# EAGLE board XMICRO-VDP V1.1 (EAGLE 6.3)
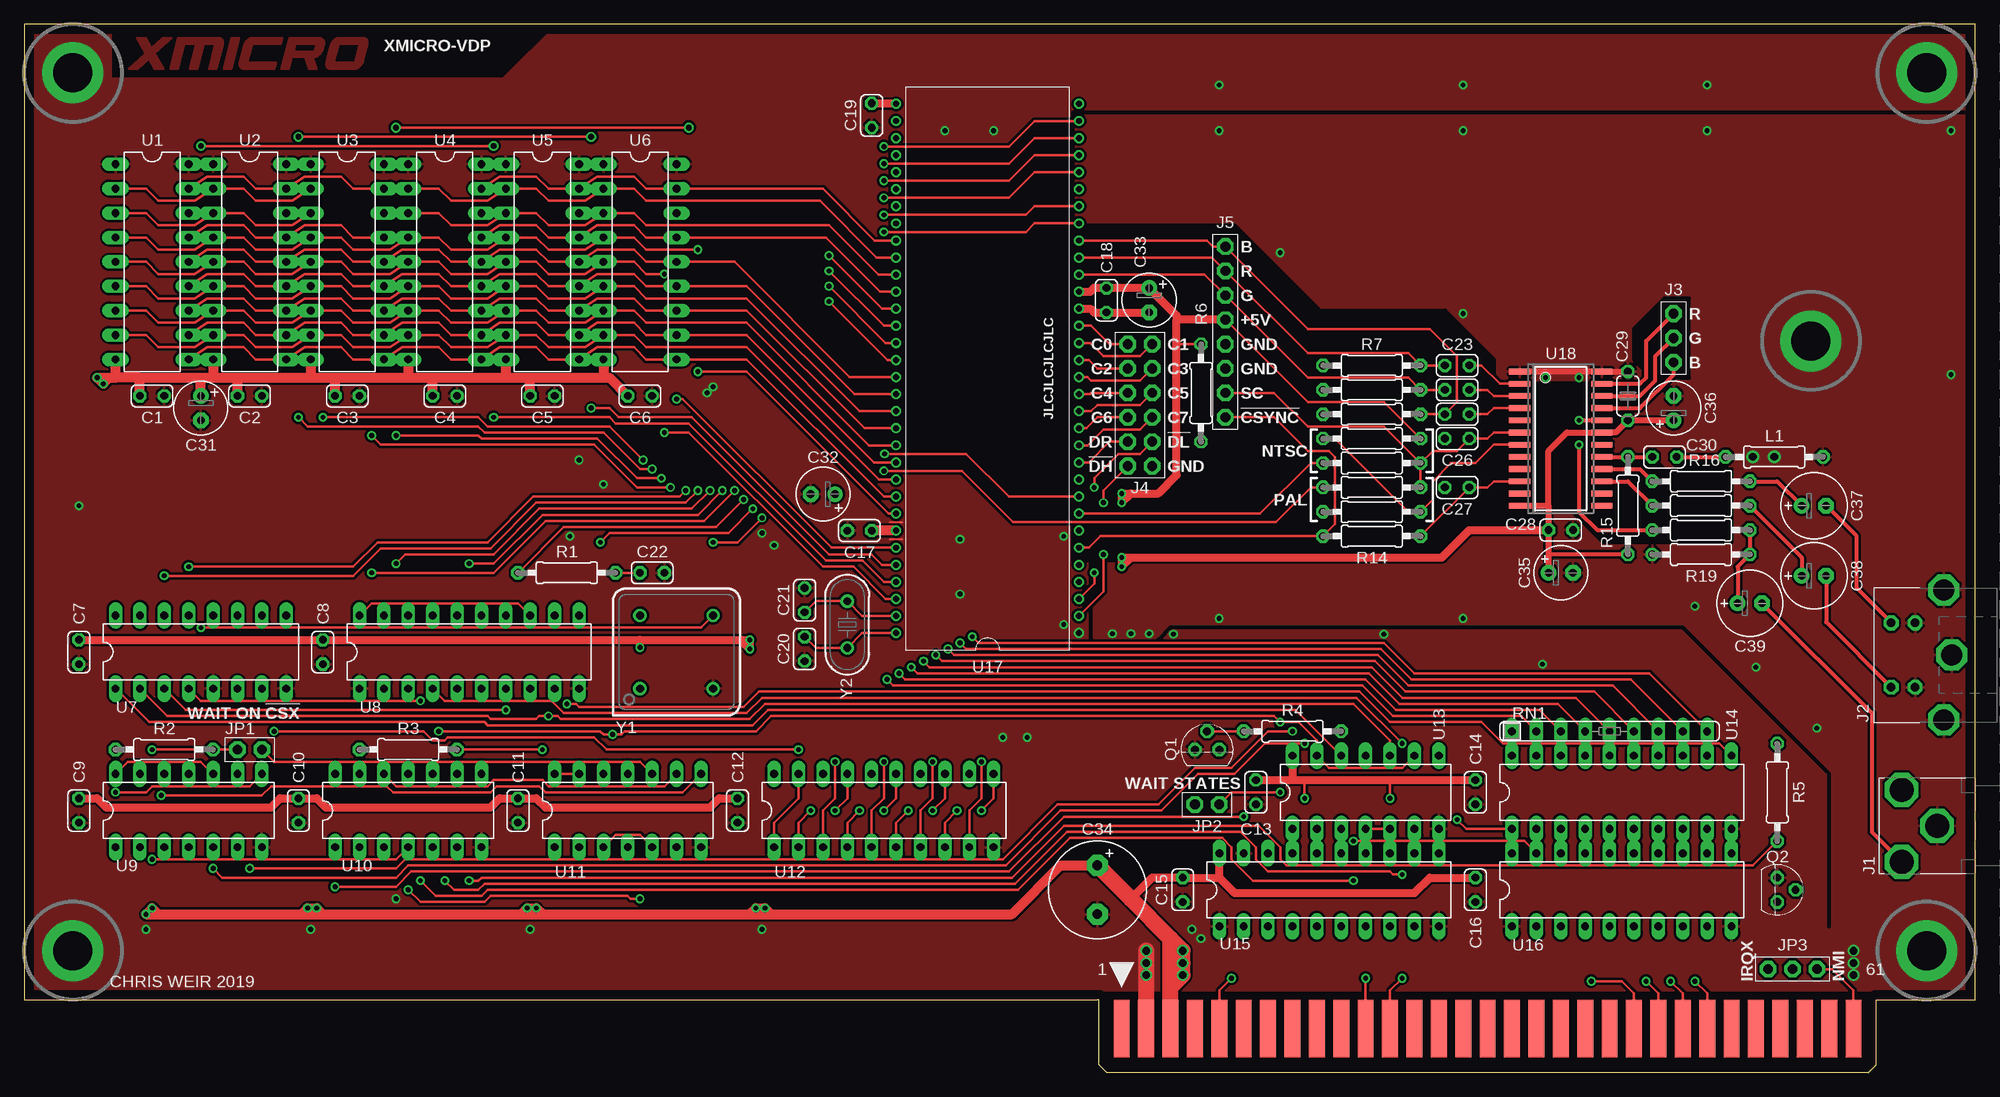
[diagram p5: board, top side]
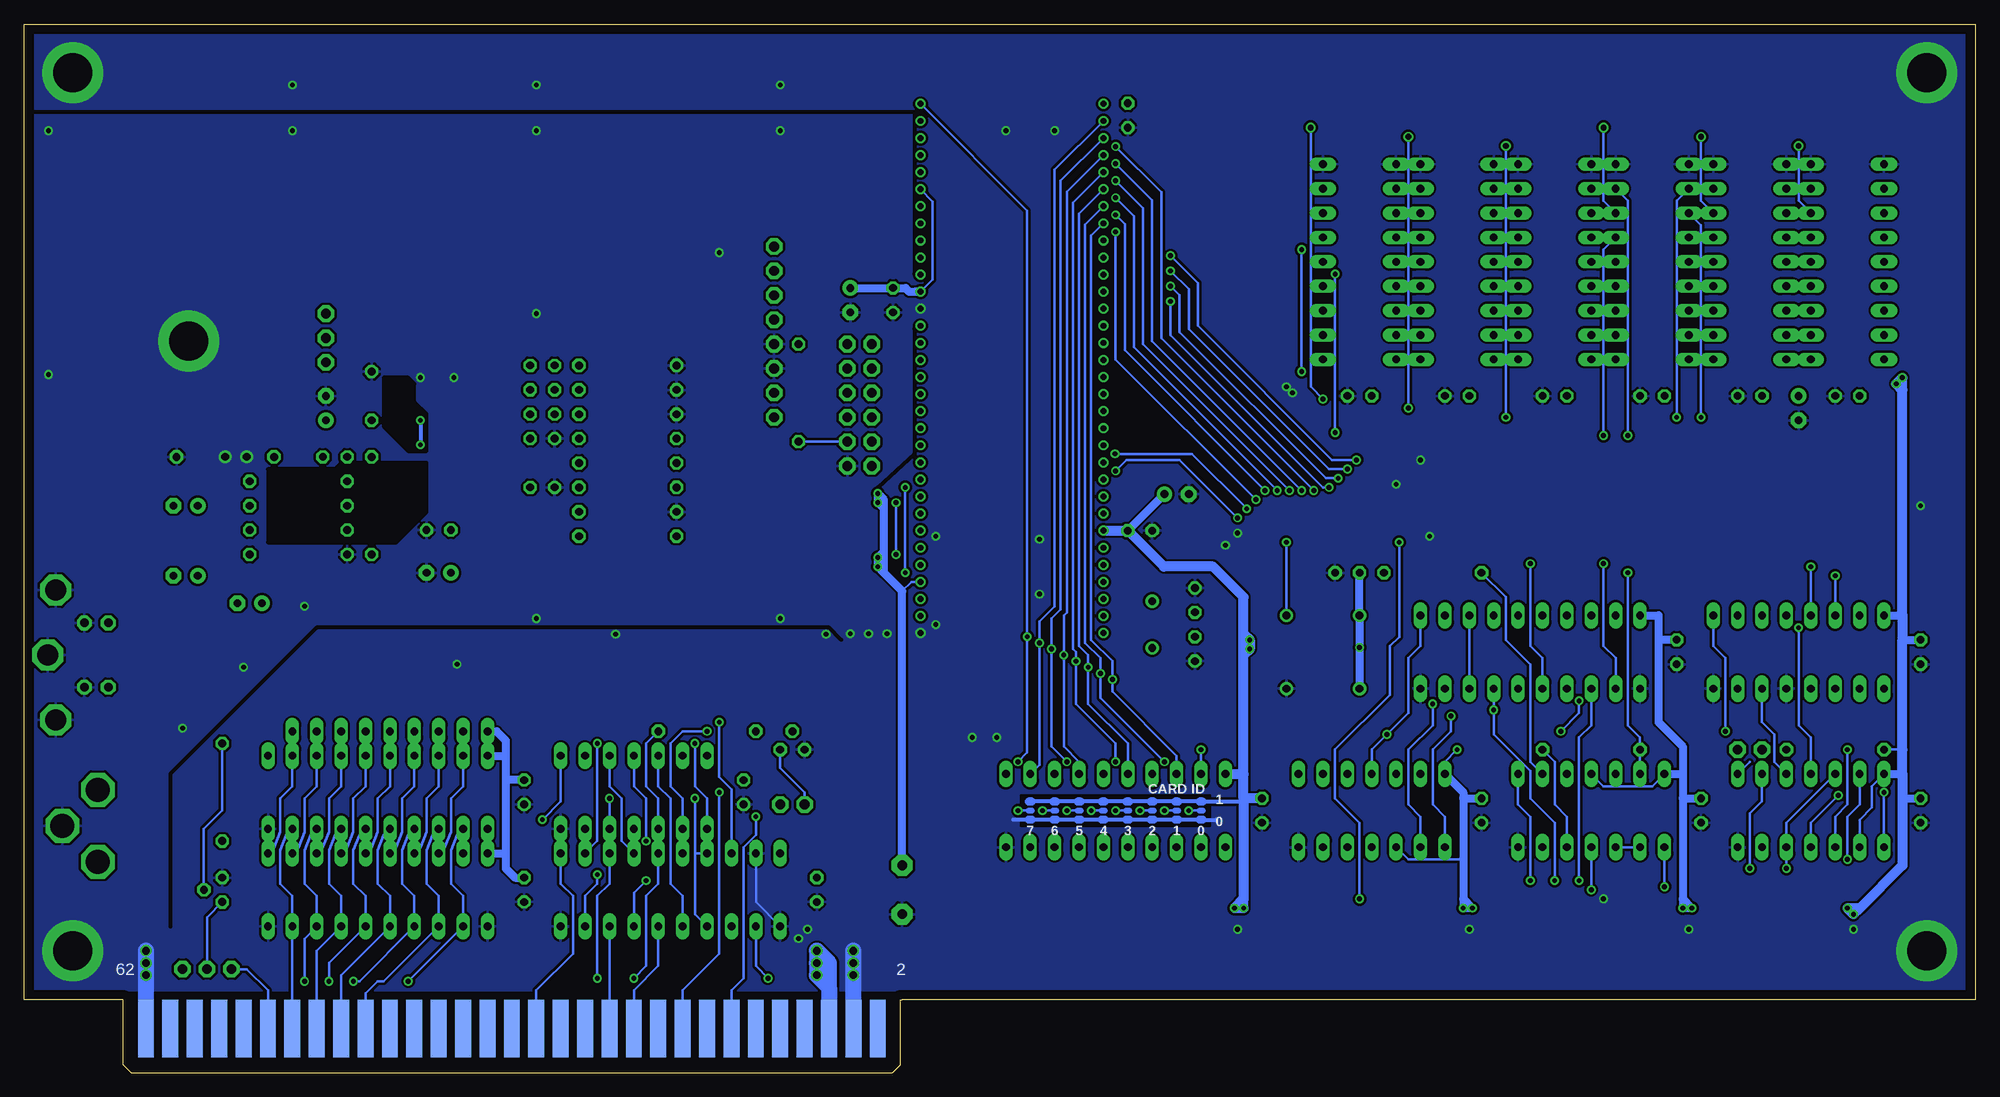
[diagram p6: board, bottom side, seen from below]

Size 203.2 x 109.22 mm. Coordinates in mm from the lower left corner, seen from the top.
Outline: 111.76,7.62 0,7.62 0,109.22 203.2,109.22 203.2,7.62 193.04,7.62
Copper layers (1*16): Top 0.035mm / dielectric 1.5mm / Bottom 0.035mm
Design rules "default *": minimum track width 6mil, minimum drill 0.3mm, track to track 10mil, track to pad 9mil, pad to pad 10mil, via to via 10mil, smd to smd 10mil, copper to edge 40mil, drill to drill 10mil, minimum pad ring 8mil, minimum via ring 8mil, stop-mask expansion 3mil, vias tented up to drill 30mil, thermal gap 10mil
Net classes: 0 default: width 0.254 mm; 1 GND: width 0.254 mm, clearance 0.254 mm to class 0; 2 SUPPLY: width 0.254 mm, clearance 0.254 mm to class 0, clearance 0.381 mm to class 1; 3 LOGO: width 0.152 mm
tRestrict: area 109.2,53.3 to 153,88.3; area 161.3,55.2 to 177.8,63.5; area 167.6,72.4 to 173.4,80.6; 9 lines
bRestrict: area 79.7,25.7 to 99.4,28.9; area 161.3,64.8 to 165.7,72.4; area 161.3,55.2 to 177.8,63.5; 8 lines

## Footprints (pad centres in the part's own frame; a part is rotated, then mirrored left to right if it is on the bottom)
C100 = drill 0.8 octagon: P$1 -1.27,0; P$2 1.27,0
C050-024X044 = drill 0.813 octagon: 1 -2.54,0; 2 2.54,0
E2,5-6 = drill 0.813 pad 1.6: + -1.27,0 | drill 0.813 pad 1.6 octagon: - 1.27,0
C-10-5 = drill 1.016 pad 2.184 octagon: + -2.54,0; - 2.54,0
E2,5-7 = drill 0.813 pad 1.6: + -1.27,0 | drill 0.813 pad 1.6 octagon: - 1.27,0
EDGE62M = smd 1.651 x 5.969: 1 -38.1,-3.01; 3 -35.56,-3.01; 5 -33.02,-3.01; 7 -30.48,-3.01; 9 -27.94,-3.01; 11 -25.4,-3.01; 13 -22.86,-3.01; 15 -20.32,-3.01; 17 -17.78,-3.01; 19 -15.24,-3.01; 21 -12.7,-3.01; 23 -10.16,-3.01; 25 -7.62,-3.01; 27 -5.08,-3.01; 29 -2.54,-3.01; 31 0,-3.01; 33 2.54,-3.01; 35 5.08,-3.01; 37 7.62,-3.01; 39 10.16,-3.01; 41 12.7,-3.01; 43 15.24,-3.01; 45 17.78,-3.01; 47 20.32,-3.01; 49 22.86,-3.01; 51 25.4,-3.01; 53 27.94,-3.01; 55 30.48,-3.01; 57 33.02,-3.01; 59 35.56,-3.01; 61 38.1,-3.01 | smd 1.651 x 5.969 bottom: 2 -38.1,-3.01; 4 -35.56,-3.01; 6 -33.02,-3.01; 8 -30.48,-3.01; 10 -27.94,-3.01; 12 -25.4,-3.01; 14 -22.86,-3.01; 16 -20.32,-3.01; 18 -17.78,-3.01; 20 -15.24,-3.01; 22 -12.7,-3.01; 24 -10.16,-3.01; 26 -7.62,-3.01; 28 -5.08,-3.01; 30 -2.54,-3.01; 32 0,-3.01; 34 2.54,-3.01; 36 5.08,-3.01; 38 7.62,-3.01; 40 10.16,-3.01; 42 12.7,-3.01; 44 15.24,-3.01; 46 17.78,-3.01; 48 20.32,-3.01; 50 22.86,-3.01; 52 25.4,-3.01; 54 27.94,-3.01; 56 30.48,-3.01; 58 33.02,-3.01; 60 35.56,-3.01; 62 38.1,-3.01
PJRAN1 = drill 2.5 octagon: SHUNT 3.75,7.7; SLEEVE 0,4; TIP -3.75,7.7
MINI-DIN4 = drill 0.9 octagon: 1 -3.35,-8.51; 2 3.35,-8.51; 3 -3.35,-11; 4 3.35,-11 | drill 2.2 octagon: G$1 6.76,-5.51; G$2 -6.76,-5.51; G$3 0,-4.7
1X03 = drill 1.016 octagon: 1 -2.54,0; 2 0,0; 3 2.54,0
2X06 = drill 1.016 octagon: 1 -6.35,-1.27; 2 -6.35,1.27; 3 -3.81,-1.27; 4 -3.81,1.27; 5 -1.27,-1.27; 6 -1.27,1.27; 7 1.27,-1.27; 8 1.27,1.27; 9 3.81,-1.27; 10 3.81,1.27; 11 6.35,-1.27; 12 6.35,1.27
1X08 = drill 1.016 octagon: 1 -8.89,0; 2 -6.35,0; 3 -3.81,0; 4 -1.27,0; 5 1.27,0; 6 3.81,0; 7 6.35,0; 8 8.89,0
1X02 = drill 1.016 octagon: 1 -1.27,0; 2 1.27,0
0207/10 = drill 0.813 octagon: 1 -5.08,0; 2 5.08,0
TO92 = drill 0.813 octagon: 1 -1.27,0; 2 0,1.905; 3 1.27,0
SIL9 = drill 0.813 long: 1 -10.16,0; 2 -7.62,0; 3 -5.08,0; 4 -2.54,0; 5 0,0; 6 2.54,0; 7 5.08,0; 8 7.62,0; 9 10.16,0
DIL18 = drill 0.813 long: 1 -10.16,-3.81; 2 -7.62,-3.81; 3 -5.08,-3.81; 4 -2.54,-3.81; 5 0,-3.81; 6 2.54,-3.81; 7 5.08,-3.81; 8 7.62,-3.81; 9 10.16,-3.81; 10 10.16,3.81; 11 7.62,3.81; 12 5.08,3.81; 13 2.54,3.81; 14 0,3.81; 15 -2.54,3.81; 16 -5.08,3.81; 17 -7.62,3.81; 18 -10.16,3.81
DIL16 = drill 0.813 long: 1 -8.89,-3.81; 2 -6.35,-3.81; 3 -3.81,-3.81; 4 -1.27,-3.81; 5 1.27,-3.81; 6 3.81,-3.81; 7 6.35,-3.81; 8 8.89,-3.81; 9 8.89,3.81; 10 6.35,3.81; 11 3.81,3.81; 12 1.27,3.81; 13 -1.27,3.81; 14 -3.81,3.81; 15 -6.35,3.81; 16 -8.89,3.81
DIL20 = drill 0.813 long: 1 -11.43,-3.81; 2 -8.89,-3.81; 3 -6.35,-3.81; 4 -3.81,-3.81; 5 -1.27,-3.81; 6 1.27,-3.81; 7 3.81,-3.81; 8 6.35,-3.81; 9 8.89,-3.81; 10 11.43,-3.81; 11 11.43,3.81; 12 8.89,3.81; 13 6.35,3.81; 14 3.81,3.81; 15 1.27,3.81; 16 -1.27,3.81; 17 -3.81,3.81; 18 -6.35,3.81; 19 -8.89,3.81; 20 -11.43,3.81
DIL14 = drill 0.813 long: 1 -7.62,-3.81; 2 -5.08,-3.81; 3 -2.54,-3.81; 4 0,-3.81; 5 2.54,-3.81; 6 5.08,-3.81; 7 7.62,-3.81; 8 7.62,3.81; 9 5.08,3.81; 10 2.54,3.81; 11 0,3.81; 12 -2.54,3.81; 13 -5.08,3.81; 14 -7.62,3.81
SDIP64 = drill 0.61 pad 1.016: 1 -27.559,-9.525; 2 -25.781,-9.525; 3 -24.003,-9.525; 4 -22.225,-9.525; 5 -20.447,-9.525; 6 -18.669,-9.525; 7 -16.891,-9.525; 8 -15.113,-9.525; 9 -13.335,-9.525; 10 -11.557,-9.525; 11 -9.779,-9.525; 12 -8.001,-9.525; 13 -6.223,-9.525; 14 -4.445,-9.525; 15 -2.667,-9.525; 16 -0.889,-9.525; 17 0.889,-9.525; 18 2.667,-9.525; 19 4.445,-9.525; 20 6.223,-9.525; 21 8.001,-9.525; 22 9.779,-9.525; 23 11.557,-9.525; 24 13.335,-9.525; 25 15.113,-9.525; 26 16.891,-9.525; 27 18.669,-9.525; 28 20.447,-9.525; 29 22.225,-9.525; 30 24.003,-9.525; 31 25.781,-9.525; 32 27.559,-9.525; 33 27.559,9.525; 34 25.781,9.525; 35 24.003,9.525; 36 22.225,9.525; 37 20.447,9.525; 38 18.669,9.525; 39 16.891,9.525; 40 15.113,9.525; 41 13.335,9.525; 42 11.557,9.525; 43 9.779,9.525; 44 8.001,9.525; 45 6.223,9.525; 46 4.445,9.525; 47 2.667,9.525; 48 0.889,9.525; 49 -0.889,9.525; 50 -2.667,9.525; 51 -4.445,9.525; 52 -6.223,9.525; 53 -8.001,9.525; 54 -9.779,9.525; 55 -11.557,9.525; 56 -13.335,9.525; 57 -15.113,9.525; 58 -16.891,9.525; 59 -18.669,9.525; 60 -20.447,9.525; 61 -22.225,9.525; 62 -24.003,9.525; 63 -25.781,9.525; 64 -27.559,9.525
SOP-24 = smd 0.6 x 2.2: 1 -6.985,-4.282; 2 -5.715,-4.282; 3 -4.445,-4.282; 4 -3.175,-4.282; 5 -1.905,-4.282; 6 -0.635,-4.282; 7 0.635,-4.282; 8 1.905,-4.282; 9 3.175,-4.282; 10 4.445,-4.282; 11 5.715,-4.282; 12 6.985,-4.282; 13 6.985,4.282; 14 5.715,4.282; 15 4.445,4.282; 16 3.175,4.282; 17 1.905,4.282; 18 0.635,4.282; 19 -0.635,4.282; 20 -1.905,4.282; 21 -3.175,4.282; 22 -4.445,4.282; 23 -5.715,4.282; 24 -6.985,4.282
DIL08S = drill 0.813: 1 -3.81,-3.81; 4 3.81,-3.81; 5 3.81,3.81; 8 -3.81,3.81
HC-49US = drill 0.813: 1 -2.44,0; 2 2.44,0

## Placement (x,y rotation side)
C1  0.1uF  [C100]  13.34,70.48 0 top
C2  0.1uF  [C100]  23.5,70.48 0 top
C3  0.1uF  [C100]  33.66,70.48 0 top
C4  0.1uF  [C100]  43.81,70.48 0 top
C5  0.1uF  [C100]  53.98,70.48 0 top
C6  0.1uF  [C100]  64.14,70.48 0 top
C7  0.1uF  [C100]  5.71,43.81 270 top
C8  0.1uF  [C100]  31.11,43.81 270 top
C9  0.1uF  [C100]  5.71,27.3 270 top
C10  0.1uF  [C100]  28.57,27.3 270 top
C11  0.1uF  [C100]  51.44,27.3 270 top
C12  0.1uF  [C100]  74.3,27.3 270 top
C13  0.1uF  [C100]  128.27,29.21 270 top
C14  0.1uF  [C100]  151.13,29.21 270 top
C15  0.1uF  [C100]  120.65,19.05 270 top
C16  0.1uF  [C100]  151.13,19.05 270 top
C17  0.1uF  [C100]  87,56.45 180 top
C18  0.1uF  [C100]  112.71,80.45 270 top
C19  0.1uF  [C100]  88.27,99.7 270 top
C20  22pF  [C100]  81.28,44.13 270 top
C21  22pF  [C100]  81.28,49.21 90 top
C22  0.1uF  [C100]  65.41,52.07 0 top
C23  0.1uF  [C100]  149.22,73.66 0 top
C24  0.1uF  [C100]  149.22,71.12 0 top
C25  0.1uF  [C100]  149.22,68.58 0 top
C26  5pF  [C100]  149.22,66.04 180 top
C27  47pF  [C100]  149.22,60.96 180 top
C28  10nF  [C100]  160.02,56.52 0 top
C29  10nF  [C050-024X044]  167,70.48 90 top
C30  28pF  [C100]  170.81,64.14 0 top
C31  47uF  [E2,5-6]  18.41,69.22 270 top
C32  47uF  [E2,5-6]  83.19,60.26 180 top
C33  47uF  [E2,5-6]  117.16,80.45 270 top
C34  470uF  [C-10-5]  111.76,19.05 270 top
C35  47uF  [E2,5-6]  160.02,52.07 0 top
C36  47uF  [E2,5-6]  171.77,69.22 90 top
C37  220uF  [E2,5-7]  186.37,59.05 0 top
C38  220uF  [E2,5-7]  186.37,51.75 0 top
C39  220uF  [E2,5-7]  179.71,48.89 0 top
CE1  XMICRO-BUS-EDGE62M  [EDGE62M]  152.4,7.62 0 top
J1  PJRAN1XU04AUX  [PJRAN1]  203.2,25.72 90 top
J2  MINI-DIN4  [MINI-DIN4]  205.42,43.5 270 top
J3  PINHD1X3  [1X03]  171.77,76.52 270 top
J4  PINHD-2X6  [2X06]  116.2,69.53 270 top
J5  PINHD-1X8  [1X08]  125.09,77.15 270 top
JP1  PINHD-1X2THRU  [1X02]  23.5,33.66 180 top
JP2  PINHD-1X2THRU  [1X02]  123.19,27.94 0 top
JP3  PINHD1X3THRU  [1X03]  184.15,10.79 0 top
L1  68uH  [0207/10]  182.25,64.14 0 top
Q1  VN2106  [TO92]  123.19,33.66 0 top
Q2  VN2106  [TO92]  182.56,19.05 270 top
R1  3.3k  [0207/10]  56.52,52.07 0 top
R2  10k  [0207/10]  14.61,33.66 180 top
R3  3.3k  [0207/10]  40.01,33.66 0 top
R4  0  [0207/10]  132.08,35.56 180 top
R5  0  [0207/10]  182.56,29.21 90 top
R6  3.3k  [0207/10]  122.56,70.8 90 top
R7  470  [0207/10]  140.34,73.66 0 top
R8  470  [0207/10]  140.34,71.12 0 top
R9  470  [0207/10]  140.34,68.58 0 top
R10  0  [0207/10]  140.34,66.04 0 top
R11  2.2k  [0207/10]  140.34,63.5 0 top
R12  2.2k  [0207/10]  140.34,60.96 0 top
R13  0  [0207/10]  140.34,58.42 180 top
R14  2.2k  [0207/10]  140.34,55.88 0 top
R15  3.32k/1%  [0207/10]  167,59.05 90 top
R16  75  [0207/10]  174.62,61.59 0 top
R17  75  [0207/10]  174.62,59.05 0 top
R18  43  [0207/10]  174.62,56.52 0 top
R19  240  [0207/10]  174.62,53.97 0 top
RN1  3.3k  [SIL9]  165.1,35.56 0 top
U1  41464  [DIL18]  13.34,84.45 270 top
U2  41464  [DIL18]  23.5,84.45 270 top
U3  41464  [DIL18]  33.66,84.45 270 top
U4  41464  [DIL18]  43.81,84.45 270 top
U5  41464  [DIL18]  53.98,84.45 270 top
U6  41464  [DIL18]  64.14,84.45 270 top
U7  74138  [DIL16]  18.41,43.81 0 top
U8  74373  [DIL20]  46.35,43.81 0 top
U9  7474  [DIL14]  17.14,27.3 0 top
U10  7414  [DIL14]  40.01,27.3 0 top
U11  7404  [DIL14]  62.87,27.3 0 top
U12  74244  [DIL20]  89.53,27.3 0 top
U13  7432  [DIL14]  139.7,29.21 0 top
U14  74574  [DIL20]  166.37,29.21 0 top
U15  74244  [DIL20]  135.89,19.05 0 top
U16  74245  [DIL20]  166.37,19.05 0 top
U17  V9958  [SDIP64]  100.33,73.34 90 top
U18  CXA2075  [SOP-24]  160.02,66.04 270 top
Y1  5MHz  [DIL08S]  67.94,43.81 0 top
Y2  21.47727MHz  [HC-49US]  85.72,46.67 90 top

## Tracks (layer width: path | path; a pad name or v marks a point on that pad's centre or on a via)
!BCSX  (via drill 0.5)
  Top 0.254: CE1.9 124.46,8.57 v125.73,9.84
  Bottom 0.254: v125.73,9.84 127,11.11 U15.2
!BRD  (via drill 0.5)
  Top 0.254: CE1.21 v139.7,9.84
  Bottom 0.254: v139.7,9.84 138.43,11.11 138.43,18.41 137.16,19.68 U15.15
!BRST  (via drill 0.5)
  Top 0.254: v127,26.67 108.27,26.67 102.55,20.96 40.32,20.96 38.73,19.37 v32.38,19.37
  Bottom 0.254: CE1.14 129.54,8.57 128.27,9.84 128.27,23.5 127,24.77 v127,26.67 | v32.38,19.37 U10.1
!BWAIT  (via drill 0.5)
  Top 0.254: v130.81,29.21 125.73,29.21 JP2.2
  Bottom 0.254: CE1.18 134.62,8.57 130.81,12.38 v130.81,29.21
!BWR
  Bottom 0.254: CE1.22 139.7,8.57 137.16,11.11 U15.6
!CSIDR  (via drill 0.5)
  Top 0.254: U12.1 78.11,26.04 80.64,28.57 U12.19 | v26.04,35.56 41.59,35.56 42.55,34.61 43.81,34.61 44.13,34.92 59.37,34.92 60.64,33.66 v80.64,33.66
  Bottom 0.254: U7.9 27.3,44.45 26.04,43.18 v26.04,35.56 | v80.64,33.66 U12.19
!CSVR  (via drill 0.5)
  Top 0.254: v17.14,52.7 34.29,52.7 36.83,55.24 48.26,55.24 53.02,60.01 68.26,60.01 v68.9,60.64 | v89.53,96.46 102.55,96.46 105.22,99.12 U17.31
  Bottom 0.254: v17.14,52.7 U7.13 | v89.53,96.46 84.77,91.69 84.77,76.52 v68.9,60.64
!CSVW  (via drill 0.5)
  Top 0.254: v70.17,60.64 68.9,59.37 53.34,59.37 48.58,54.61 37.15,54.61 34.29,51.75 v14.61,51.75 | v89.53,94.68 102.55,94.68 105.22,97.34 U17.30
  Bottom 0.254: v14.61,51.75 U7.14 | v89.53,94.68 85.72,90.87 85.72,76.2 v70.17,60.64
!CSX  (via drill 0.5)
  Top 0.254: U13.9 143.51,31.75 135.89,31.75 U13.13 134.62,34.61 132.72,36.51 v130.81,36.51 130.18,37.15 77.79,37.15 76.2,35.56 62.55,35.56 62.23,35.24 v61.28,35.24 60.33,35.24 60.01,35.56 v43.18,35.56 | U7.4 18.41,38.73 v41.27,38.73
  Bottom 0.254: U15.18 129.54,29.53 130.81,30.8 v130.81,36.51 | U11.11 62.87,33.66 v61.28,35.24 59.05,37.46 59.05,43.18 57.78,44.45 U8.11 | v41.27,38.73 41.27,37.46 v43.18,35.56
!CSYNC
  Top 0.254: U17.6 110.87,54.67 112.08,55.88 R14.1 136.53,57.15 136.53,64.14 135.89,64.77 133.67,64.77 130.18,68.26 J5.8
!DHCLK  (via drill 0.5)
  Top 0.254: U17.2 112.39,50.1 v112.39,53.97 | v112.39,59.37 112.39,60.64 J4.11
  Bottom 0.254: v112.39,53.97 v112.39,59.37
!DLCLK  (via drill 0.5)
  Top 0.254: U17.3 111.44,50.93 v111.44,52.07 | v111.44,60.96 111.44,61.91 113.98,64.45 116.2,64.45 J4.10
  Bottom 0.254: v111.44,52.07 v111.44,60.96 | J4.10 R6.1
!RD
  Top 0.254: U13.12 132.4,37.78 77.47,37.78 75.88,36.2 48.26,36.2 47.94,36.51 13.02,36.51 U7.1
  Bottom 0.254: U15.5 134.62,18.41 135.89,19.68 135.89,28.57 137.16,29.85 U13.12
!RST  (via drill 0.5)
  Top 0.254: U17.9 102.55,60.01 98.11,64.45 v89.6,64.45 | v75.88,58.74 73.34,56.2 60.96,56.2 v60.01,55.24 | v13.34,22.23 38.73,22.23 U10.4 | v64.14,18.1 63.18,18.1 62.87,18.41 48.58,18.41 47.94,17.78 41.27,17.78 v40.01,19.05
  Bottom 0.254: v89.6,64.45 81.6,64.45 v75.88,58.74 | U9.13 12.06,27.94 13.34,26.67 v13.34,22.23 | v60.01,55.24 60.01,45.4 60.96,44.45 60.96,39.37 66.67,33.66 66.67,28.57 64.14,26.04 v64.14,18.1 | v40.01,19.05 U10.4
!VCAS0  (via drill 0.5, 0.6)
  Top 0.254: v48.9,96.52 v18.41,96.52 | v48.9,68.26 60.96,68.26 61.59,67.63 69.22,67.63 83.5,53.34 87.31,53.34 89.53,51.12 U17.61
  Bottom 0.254: 48.9,89.54 v48.9,96.52 | v18.41,96.52 18.41,90.81 U1.16 | U4.16 48.9,89.54 | 48.9,89.54 v48.9,68.26
!VCAS1  (via drill 0.5, 0.6)
  Top 0.254: U17.60 89.34,52.9 88.27,53.97 83.82,53.97 69.53,68.26 61.91,68.26 60.96,69.22 v59.05,69.22 | v59.05,97.47 v28.57,97.47
  Bottom 0.254: 59.05,89.54 v59.05,97.47 | v28.57,97.47 28.57,90.81 U2.16 | U5.16 59.05,89.54 | 59.05,89.54 v59.05,69.22
!VCAS2  (via drill 0.5, 0.6)
  Top 0.254: v38.73,98.43 v69.22,98.43 | v67.94,70.17 68.58,70.17 84.07,54.67 U17.59
  Bottom 0.254: U3.16 38.73,90.81 v38.73,98.43 | v69.22,98.43 69.22,89.54 | U6.16 69.22,89.54 | 69.22,89.54 69.22,71.44 v67.94,70.17
!VINT  (via drill 0.5)
  Top 0.254: U17.25 105.22,88.45 104.33,87.57 v89.53,87.57 | v74.93,59.69 72.07,56.83 56.2,56.83 R1.1
  Bottom 0.254: U10.9 46.35,32.38 46.35,42.54 48.9,45.09 48.9,49.53 R1.1 | v89.53,87.57 89.53,74.3 v74.93,59.69
!VRAS  (via drill 0.5)
  Top 0.254: v66.67,66.67 69.22,66.67 83.19,52.7 86.36,52.7 89.72,49.34 U17.62 | U1.5 12.7,84.45 13.97,83.19 17.78,83.19 U2.5 22.86,84.45 24.13,83.19 27.94,83.19 U3.5 33.02,84.45 34.29,83.19 38.1,83.19 U4.5 43.18,84.45 44.45,83.19 48.26,83.19 U5.5 53.34,84.45 54.61,83.19 58.42,83.19 U6.5 63.5,84.45 64.77,83.19 v66.67,83.19
  Bottom 0.254: v66.67,83.19 v66.67,66.67
!VWAIT  (via drill 0.5)
  Top 0.254: U17.26 105.22,90.23 104.33,89.34 v89.53,89.34 | v73.98,60.64 70.8,57.47 54.29,57.47 48.9,52.07 v36.2,52.07
  Bottom 0.254: U10.13 R3.1 34.92,34.92 36.2,36.2 v36.2,52.07 | v89.53,89.34 88.58,88.39 88.58,75.25 v73.98,60.64
!WR  (via drill 0.5)
  Top 0.254: U13.10 142.24,34.61 138.43,38.42 77.15,38.42 75.56,36.83 55.88,36.83 55.56,37.15 v54.61,37.15 53.66,37.15 53.34,36.83 48.58,36.83 48.26,37.15 14.92,37.15 U7.2
  Bottom 0.254: U15.14 140.97,24.13 140.97,28.57 142.24,29.85 U13.10 | U11.1 55.24,26.67 56.52,27.94 56.52,33.66 54.61,35.56 v54.61,37.15
A0  (via drill 0.5)
  Top 0.254: v138.43,20 127.95,20 125.73,22.23 125.73,23.5 124.78,24.45 108.9,24.45 103.5,19.05 48.26,19.05 47.62,18.41 42.86,18.41 v41.27,20
  Bottom 0.254: U15.7 139.7,18.73 v138.43,20 | v41.27,20 41.27,34.92 40.01,36.2 U8.3
A1  (via drill 0.5)
  Top 0.254: v143.51,34.29 138.75,39.05 76.83,39.05 75.25,37.46 56.2,37.46 54.93,38.73 43.81,38.73 U8.4
  Bottom 0.254: U15.12 143.51,24.13 v143.51,34.29
A7  (via drill 0.5)
  Top 0.254: v143.51,20.64 142.56,20.64 142.24,20.96 129.54,20.96 128.27,22.23 128.27,23.5 126.68,25.08 108.58,25.08 103.19,19.68 47.94,19.68 47.31,19.05 44.77,19.05 v43.81,20 | U7.3 16.83,37.78 v50.16,37.78
  Bottom 0.254: U15.9 144.78,18.41 143.51,19.68 v143.51,20.64 | v43.81,20 43.81,26.04 46.35,28.57 46.35,31.43 50.16,35.24 v50.16,37.78 U8.7
B
  Top 0.254: R9.2 C25.P$1 149.22,69.85 149.22,74.61 146.37,77.47 133.67,77.47 J5.1 123.83,86.04 123.19,86.68 U17.24
BA0  (via drill 0.5)
  Top 0.254: CE1.23 142.24,8.57 v143.51,9.84
  Bottom 0.254: v143.51,9.84 143.51,18.41 142.24,19.68 U15.13
BA1
  Bottom 0.254: CE1.24 U15.8
BA7
  Bottom 0.254: CE1.30 149.86,8.57 146.05,12.38 146.05,18.41 147.32,19.68 U15.11
C0
  Top 0.254: U17.19 111.12,77.79 113.03,75.88 J4.1
C1
  Top 0.254: U17.18 111,76.01 112.39,74.61 116.2,74.61 J4.2
C2
  Top 0.254: U17.17 110.87,74.23 111.76,73.34 J4.3
C3
  Top 0.254: U17.16 110.74,72.45 111.12,72.07 116.2,72.07 J4.4
C4
  Top 0.254: U17.15 111,70.68 111.12,70.8 J4.5
C5
  Top 0.254: U17.14 111.12,68.9 111.76,69.53 116.2,69.53 J4.6
C6
  Top 0.254: U17.13 110.62,67.12 111.76,68.26 J4.7
C7
  Top 0.254: U17.12 110.74,65.34 112.39,66.99 116.2,66.99 J4.8
CBDR
  Top 0.254: U17.11 110.87,63.56 113.03,65.72 J4.9
D0  (via drill 0.5)
  Top 0.254: RN1.2 155.89,37.15 142.56,37.15 139.38,40.32 90.49,40.32 v89.85,40.96
  Bottom 0.254: U16.18 159.38,23.5 158.75,25.08 158.75,28.57 157.48,29.85 U14.19 RN1.2 | U17.40 92.08,87.19 92.08,45.09 89.85,42.86 v89.85,40.96 89.85,39.69 83.19,33.02 U12.18
D1  (via drill 0.5)
  Top 0.254: RN1.3 157.8,37.78 142.88,37.78 139.7,40.96 91.76,40.96 v91.12,41.59 | U12.3 83.19,27.3 84.45,28.57 v84.45,32.38
  Bottom 0.254: U16.17 161.93,23.5 161.29,25.08 161.29,28.57 160.02,29.85 U14.18 RN1.3 | U17.39 92.71,88.33 92.71,44.77 91.12,43.18 v91.12,41.59 91.12,39.05 v84.45,32.38
D2  (via drill 0.5)
  Top 0.254: RN1.4 159.7,38.42 143.19,38.42 140.02,41.59 93.03,41.59 v92.39,42.23
  Bottom 0.254: U16.16 164.47,23.5 163.83,25.08 163.83,28.57 162.56,29.85 U14.17 RN1.4 | U17.38 93.34,89.47 93.34,44.45 92.39,43.5 v92.39,42.23 92.39,38.42 88.27,34.29 U12.16
D3  (via drill 0.5)
  Top 0.254: RN1.5 161.61,39.05 143.51,39.05 140.34,42.23 94.3,42.23 v93.66,42.86 | U12.5 88.27,27.3 89.53,28.57 v89.53,32.38
  Bottom 0.254: U16.15 167,23.5 166.37,25.08 166.37,28.57 165.1,29.85 U14.16 RN1.5 | U17.37 93.98,90.62 93.98,44.13 93.66,43.81 v93.66,42.86 93.66,38.42 89.53,34.29 v89.53,32.38
D4  (via drill 0.5)
  Top 0.254: RN1.6 163.51,39.69 143.83,39.69 140.65,42.86 95.57,42.86 v94.93,43.5
  Bottom 0.254: U16.14 169.54,23.5 168.91,25.08 168.91,28.57 167.64,29.85 U14.15 RN1.6 | U17.36 94.61,91.76 94.61,47.94 94.93,47.62 v94.93,43.5 94.93,33.97 93.34,32.38 U12.14
D5  (via drill 0.5)
  Top 0.254: RN1.7 165.42,40.32 144.15,40.32 140.97,43.5 96.84,43.5 v96.2,44.13 | U12.7 93.34,27.3 94.61,28.57 v94.61,32.38
  Bottom 0.254: U16.13 172.09,23.5 171.45,25.08 171.45,28.57 170.18,29.85 U14.14 RN1.7 | U17.35 95.25,92.9 95.25,48.26 96.2,47.31 v96.2,44.13 96.2,33.97 v94.61,32.38
D6  (via drill 0.5)
  Top 0.254: RN1.8 167.32,40.96 144.46,40.96 141.29,44.13 98.11,44.13 v97.47,44.77
  Bottom 0.254: U16.12 174.62,23.5 173.99,25.08 173.99,28.57 172.72,29.85 U14.13 RN1.8 | U17.34 95.89,94.04 95.89,48.58 97.47,46.99 v97.47,44.77 97.47,32.07 U12.12
D7  (via drill 0.5)
  Top 0.254: RN1.9 169.23,41.59 144.78,41.59 141.6,44.77 99.38,44.77 v98.74,45.4 | U12.9 98.42,27.3 99.69,28.57 v99.69,32.38
  Bottom 0.254: U16.11 177.16,23.5 176.53,25.08 176.53,28.57 175.26,29.85 U14.12 RN1.9 | U17.32 98.74,89.79 v98.74,45.4 98.74,33.34 v99.69,32.38
G
  Top 0.254: C24.P$1 R8.2 144.15,72.39 133.67,72.39 J5.3 122.94,83.12 U17.22
GND  (via drill 0.5, 0.8, 0.8 pad 1.32, 4.06 pad 6.35)
  Top 0.229: 90.17,55.56 91.44,55.56 | 90.17,57.34 91.44,57.34
  Top 0.61: U18.1 U18.24 C29.2
  Top 0.813: U17.20 111.03,79.56 111.41,79.18 C33.-
  Top 1.651: v116.84,12.7 v116.84,11.43 v116.84,10.16 CE1.4
  Bottom 0.254: U15.19 127,17.78 U15.1
  Bottom 0.406: 98.58,26.35 100.17,26.35 | 96.04,26.35 98.27,26.35 | 93.5,26.35 95.73,26.35 | 90.96,26.35 93.19,26.35 | 88.42,26.35 90.65,26.35 | 85.88,26.35 88.11,26.35 | 83.34,26.35 85.57,26.35 | 80.8,26.35 83.03,26.35 | 80.49,26.35 79.06,26.35
  Bottom 0.813: 98.27,26.35 98.58,26.35 | 95.73,26.35 96.04,26.35 | 93.19,26.35 93.5,26.35 | 90.65,26.35 90.96,26.35 | 88.11,26.35 88.42,26.35 | 85.57,26.35 85.88,26.35 | 83.03,26.35 83.34,26.35 | 80.49,26.35 80.8,26.35
  Bottom 1.651: CE1.4 v116.84,10.16 v116.84,11.43 v116.84,12.7 | CE1.62 v190.5,10.16 v190.5,11.43 v190.5,12.7
  other vias: 5.08,12.7 5.08,104.14 158.43,72.39 161.93,72.39 198.12,12.7 198.12,104.14 57.78,63.82 182.25,64.14 180.02,64.14 121.6,14.92 122.56,13.97 56.83,55.88 78.11,54.93 76.83,56.2 119.7,45.67 141.6,45.67 158.12,42.54 108.27,46.67 104.46,34.92 101.92,34.92 97.47,49.85 97.47,55.56 38.73,18.1 52.7,14.92 76.83,14.92 29.84,14.92 12.7,14.92 60.33,61.28 95.89,98.11 100.97,98.11 113.35,45.72 117.16,45.72 115.25,45.72 186.06,76.2 108.27,55.88 200.66,98.11 175.26,98.11 149.86,98.11 124.46,98.11 149.86,79.06 130.81,85.41 200.66,72.71 124.46,47.31 149.86,47.31 173.99,48.58 186.69,35.88 180.34,42.23 175.26,102.87 149.86,102.87 124.46,102.87 5.71,59.05 71.75,71.44 71.12,70.8
  pour Bottom (rank 3): 0,109.22 203.2,109.22 203.2,7.62 192.72,7.62 192.72,8.57 112.08,8.57 112.08,7.62 0,7.62
  pour Top (rank 3): 0,109.22 9.02,109.22 9.02,103.51 49.85,103.51 55.56,109.22 203.2,109.22 203.2,7.62 192.72,7.62 192.72,8.57 112.08,8.57 112.08,7.62 0,7.62
  pour Top (isolate 0.254): 92.08,58.04 92.08,54.86 89.53,54.86 89.53,58.04
  pour Top (isolate 0.254, no thermals): 110.81,46.74 110.81,44.64 108.9,44.64 108.9,46.74
  pour Bottom (isolate 0.254, no thermals): 110.81,46.74 110.81,44.64 108.9,44.64 108.9,46.74
  pour Bottom (isolate 0.254, no thermals): 110.81,80.39 110.81,78.61 108.9,78.61 108.9,80.39
ID0  (via drill 0.5)
  Top 0.254: U12.2 80.64,26.04 v81.92,27.3
  Bottom 0.254: v81.92,27.3 80.8,27.3
  Bottom 0.61: 80.8,27.3 80.49,27.3
ID1  (via drill 0.5)
  Top 0.254: U12.17 85.72,28.57 v84.45,27.3
  Bottom 0.254: v84.45,27.3 83.34,27.3
  Bottom 0.61: 83.34,27.3 83.03,27.3
ID2  (via drill 0.5)
  Top 0.254: U12.4 85.72,26.04 v87,27.3
  Bottom 0.254: v87,27.3 85.88,27.3
  Bottom 0.61: 85.88,27.3 85.57,27.3
ID3  (via drill 0.5)
  Top 0.254: U12.15 90.81,28.57 v89.53,27.3
  Bottom 0.254: v89.53,27.3 88.42,27.3
  Bottom 0.61: 88.42,27.3 88.11,27.3
ID4  (via drill 0.5)
  Top 0.254: U12.6 90.81,26.04 v92.08,27.3
  Bottom 0.254: v92.08,27.3 90.96,27.3
  Bottom 0.61: 90.96,27.3 90.65,27.3
ID5  (via drill 0.5)
  Top 0.254: U12.13 95.89,28.57 v94.61,27.3
  Bottom 0.254: v94.61,27.3 93.5,27.3
  Bottom 0.61: 93.5,27.3 93.19,27.3
ID6  (via drill 0.5)
  Top 0.254: U12.8 95.89,26.04 v97.16,27.3
  Bottom 0.254: v97.16,27.3 96.04,27.3
  Bottom 0.61: 96.04,27.3 95.73,27.3
ID7  (via drill 0.5)
  Top 0.254: U12.11 100.97,28.57 v99.69,27.3
  Bottom 0.254: v99.69,27.3 98.58,27.3
  Bottom 0.61: 98.58,27.3 98.27,27.3
LOGO
  pour Top: 26.95,107.79 26.78,107.1 23.79,107.1 23.31,105.22 26.28,105.22 26.12,104.53 22.83,104.53 arc-47 22.56,104.64 arc-36 22.42,104.96 arc-17 22.43,105.22 arc-5 22.46,105.37 22.86,106.95 arc-33 23.23,107.55 arc-31 23.61,107.78 arc-13 23.75,107.79
  pour Top: 10.87,104.53 11.86,104.53 12.97,105.56 13.53,104.53 14.58,104.53 13.63,106.16 15.41,107.79 14.43,107.79 13.3,106.75 12.74,107.79 11.7,107.79 12.64,106.13
  pour Top: 21.56,107.79 22.44,107.79 21.6,104.53 20.72,104.53
  pour Top: 27.6,107.79 28.3,107.1 28.12,106.39 30.23,106.39 30.41,107.1 28.32,107.1 27.62,107.79 30.75,107.79 arc-55 31.17,107.58 arc-31 31.28,107.32 arc-18 31.25,107 31.14,106.58 arc-18 31.06,106.4 arc-18 30.75,106 arc-19 30.44,105.8 arc-14 30.09,105.74 30.52,104.53 29.65,104.53 29.21,105.75 27.94,105.75 27.62,104.53 26.75,104.53
  pour Top: 15.17,104.53 16.01,107.79 20.29,107.79 arc-50 20.62,107.66 arc-37 20.75,107.37 arc-17 20.72,106.99 20.08,104.53 19.21,104.53 19.88,107.1 18.74,107.1 18.07,104.53 17.19,104.53 17.86,107.1 16.72,107.1 16.05,104.53
  pour Top: 32.83,107.1 34.92,107.1 34.42,105.22 32.3,105.22 32.8,107.1 32.85,107.79 32.75,107.79 arc33 32.36,107.65 arc19 32.07,107.33 arc18 31.89,106.95 31.47,105.35 arc9 31.45,105.25 arc9 31.44,105.01 arc22 31.48,104.8 arc36 31.61,104.62 arc17 31.73,104.55 arc13 31.87,104.53 34.45,104.53 arc18 34.66,104.55 arc16 34.84,104.65 arc14 35.08,104.87 arc26 35.33,105.34 35.77,107.01 arc17 35.79,107.29 arc19 35.75,107.51 arc66 35.37,107.79 32.88,107.79
N$1  (via drill 0.5)
  Top 0.254: v23.5,21.27 38.73,21.27 39.69,22.23 101.92,22.23 107.63,27.94 118.11,27.94 121.92,31.75 125.73,31.75 129.54,35.56 v132.08,35.56
  Bottom 0.254: U9.9 22.23,28.26 23.5,26.99 v23.5,21.27 | U13.2 134.62,28.57 135.89,29.85 135.89,34.29 134.62,35.56 v132.08,35.56
N$2
  Top 0.406: U18.21 168.28,69.22 171.77,72.71 J3.3
N$3
  Top 0.254: U18.2 153.67,71.76 151.76,73.66 C23.P$2
N$4
  Top 0.254: U18.3 153.03,70.48 152.4,71.12 C24.P$2
N$5
  Top 0.254: U18.4 153.03,69.22 152.4,68.58 C25.P$2
N$6
  Top 0.406: U18.22 168.28,70.48 169.86,72.07 169.86,74.61 J3.2
N$7
  Top 0.406: U18.23 168.28,71.76 168.91,72.39 168.91,76.2 J3.1
N$9
  Bottom 0.254: R5.2 182.56,27.3 184.47,25.4 Q2.2
N$10
  Bottom 0.254: Q2.3 184.15,16.19 JP3.2
N$11  (via drill 0.5)
  Top 0.254: v46.35,20 47.31,20 47.62,20.32 102.87,20.32 108.27,25.72 128.59,25.72 130.81,23.5 130.81,22.23 131.44,21.59 180.02,21.59 R5.1
  Bottom 0.254: v46.35,20 46.35,26.67 47.62,27.94 U10.8
N$12
  Top 0.406: U18.15 167,61.59 R17.1
N$13
  Top 0.406: U18.16 168.28,62.86 R16.1
N$14  (via drill 0.5)
  Top 0.406: U18.20 v161.93,67.95 | v161.93,65.41 161.93,58.42 163.83,56.52 R18.1
  Bottom 0.406: v161.93,67.95 v161.93,65.41
N$15
  Top 0.406: R18.2 R19.2 178.44,52.7 C39.+
N$16
  Top 0.406: R16.2 182.56,61.59 C37.+
N$17
  Top 0.406: R17.2 185.1,53.66 C38.+
N$18
  Bottom 0.254: Q1.3 124.46,31.75 121.92,29.21 JP2.1
N$19  (via drill 0.5)
  Top 0.254: v14.29,28.89 24.77,28.89 25.72,29.85 37.78,29.85 38.42,29.21 48.58,29.21 49.21,29.85 53.66,29.85 54.29,29.21 68.58,29.21 U11.8
  Bottom 0.254: v14.29,28.89 17.14,26.04 U9.4
N$20
  Top 0.254: U10.12 38.73,29.85 48.26,29.85 48.9,30.48 53.98,30.48 54.61,29.85 66.67,29.85 U11.9
N$21
  Top 0.406: C30.P$2 L1.1
N$22
  Top 0.254: U18.10 153.03,61.59 152.4,60.96 C27.P$1 R14.2
N$26
  Top 0.254: U18.7 153.03,65.41 151.13,63.5 148.59,63.5 146.69,61.59 146.69,59.69 R13.1 144.15,58.42 136.53,66.04 R10.1
N$27
  Bottom 0.254: U10.3 U10.2
N$28
  Top 0.254: U17.63 87.28,47.56 Y2.2 82.45,49.11 C21.P$1
N$29
  Top 0.406: C38.- 187.64,46.93 J2.4
N$30
  Top 0.254: U17.64 87.28,45.78 Y2.1 82.45,44.23 C20.P$1
N$33
  Bottom 0.254: U14.9 175.9,24.77 176.53,23.18 176.53,19.68 175.26,18.41 U16.9 CE1.50
N$34  (via drill 0.5)
  Top 0.254: v173.99,9.53 175.26,8.26 CE1.49
  Bottom 0.254: U14.8 173.35,24.77 173.99,23.18 173.99,19.68 172.72,18.41 U16.8 173.99,13.97 v173.99,9.53
N$35
  Bottom 0.254: U14.7 170.81,24.77 171.45,23.18 171.45,19.68 170.18,18.41 U16.7 172.72,12.7 CE1.48
N$36  (via drill 0.5)
  Top 0.254: CE1.47 172.72,8.26 v171.45,9.53
  Bottom 0.254: U14.6 168.28,24.77 168.91,23.18 168.91,19.68 167.64,18.41 U16.6 171.45,11.43 v171.45,9.53
N$37
  Bottom 0.254: U14.5 165.74,24.77 166.37,23.18 166.37,19.68 165.1,18.41 U16.5 170.18,10.16 CE1.46
N$38  (via drill 0.5)
  Top 0.254: CE1.45 170.18,8.26 v168.91,9.53
  Bottom 0.254: U14.4 163.19,24.77 163.83,23.18 163.83,19.68 162.56,18.41 U16.4 168.28,9.53 v168.91,9.53
N$39
  Bottom 0.254: U14.3 160.66,24.77 161.29,23.18 161.29,19.68 160.02,18.41 U16.3 165.74,9.53 166.37,9.53 167.64,8.26 CE1.44
N$40  (via drill 0.5)
  Top 0.254: CE1.43 167.64,8.26 166.37,9.53 v163.19,9.53
  Bottom 0.254: U14.2 158.12,24.77 158.75,23.18 158.75,19.68 157.48,18.41 U16.2 v163.19,9.53
N$51
  Top 0.254: R4.2 Q1.2
N$52
  Top 0.254: U11.10 64.14,32.38 26.04,32.38 JP1.1
N$53
  Top 0.406: C39.- 192.41,37.46 192.41,25.06 J1.TIP
N$54  (via drill 0.5)
  Top 0.254: U16.19 156.21,24.13 v138.43,24.13
  Bottom 0.254: v138.43,24.13 138.43,28.57 139.7,29.85 U13.11
N$55  (via drill 0.5)
  Top 0.254: U14.11 176.53,34.29 153.99,34.29 151.76,36.51 142.24,36.51 139.06,39.69 76.52,39.69 74.93,38.1 57.78,38.1 57.47,38.42 v56.52,38.42
  Bottom 0.254: U11.2 57.78,26.67 59.05,27.94 59.05,33.66 56.52,36.2 v56.52,38.42
N$56  (via drill 0.5)
  Top 0.254: U14.1 150.18,25.4 v149.22,26.35
  Bottom 0.254: v149.22,26.35 147.32,28.26 U13.8
N$69  (via drill 0.5)
  Top 0.254: U17.29 105.22,95.57 102.55,92.9 v89.53,92.9 | v71.44,60.64 69.53,58.74 53.66,58.74 48.9,53.97 39.69,53.97 v38.73,53.02
  Bottom 0.254: v38.73,53.02 38.73,44.45 37.47,43.18 U8.2 | v89.53,92.9 86.68,90.04 86.68,75.88 v71.44,60.64
N$70
  Top 0.813: U17.33 88.33,100.9 C19.P$1
N$71
  Top 0.406: U18.17 R15.2 C30.P$1
N$72
  Top 0.254: CE1.61 190.5,8.57 188.28,10.79 JP3.3
N$73
  Bottom 0.254: R4.1 138.43,34.29 138.43,29.85 137.16,28.57 U13.3
N$74
  Bottom 0.254: CE1.52 177.8,8.57 180.02,10.79 JP3.1
N$75  (via drill 0.5)
  Top 0.254: U17.28 105.22,93.79 102.55,91.12 v89.53,91.12 | v72.71,60.64 70.17,58.1 53.98,58.1 48.9,53.02 v46.35,53.02
  Bottom 0.254: v46.35,53.02 46.35,44.45 45.09,43.18 U8.5 | v89.53,91.12 87.63,89.22 87.63,75.56 v72.71,60.64
N$77  (via drill 0.5)
  Top 0.254: v19.68,21.27 20.64,20.32 38.73,20.32 40.01,21.59 102.23,21.59 107.95,27.3 118.43,27.3 122.24,31.12 126.05,31.12 129.22,34.29 v133.35,34.29
  Bottom 0.254: U9.12 19.68,26.04 U9.5 v19.68,21.27 | U13.1 132.08,28.57 133.35,29.85 v133.35,34.29
N$79  (via drill 0.5)
  Top 0.254: v9.53,29.21 12.7,29.21 13.34,29.85 23.5,29.85 U9.8
  Bottom 0.254: U9.1 v9.53,29.21 | 23.5,32.38 U9.8
N$81
  Top 0.406: J2.3 194.42,46.88 190.82,50.48 190.82,55.88 C37.-
N$83  (via drill 0.5)
  Top 0.254: v13.34,33.66 R2.1 JP1.2
  Bottom 0.254: v13.34,33.66 13.34,27.94 14.61,26.67 U9.3
NTSC_SC
  Top 0.254: U17.8 128.71,58.23 133.99,63.5 R11.1
PAL_SC  (via drill 0.5)
  Top 0.254: v18.41,46.35 70.48,46.35 Y1.5 | R12.1 133.99,60.96 130.37,57.34 103,57.34 97.66,62.67 v89.53,62.67 | v76.83,57.78 74.3,55.24 v71.75,55.24
  Bottom 0.254: U9.11 17.14,34.92 18.41,36.2 v18.41,46.35 | v76.83,57.78 82.87,63.82 88.39,63.82 v89.53,62.67 | Y1.5 v71.75,55.24
R
  Top 0.254: C23.P$1 R7.2 144.15,74.93 133.67,74.93 J5.2 123.7,84.9 U17.23
SC
  Top 0.254: U18.6 153.03,66.67 152.4,66.04 C26.P$1 149.22,64.77 146.69,64.77 R11.2 | R12.2 R11.2 | R11.2 141.6,67.31 133.67,67.31 130.18,70.8 J5.7
VA0
  Top 0.254: U1.14 19.05,85.73 22.86,85.73 24.13,84.45 U2.14 29.21,85.73 33.02,85.73 34.29,84.45 U3.14 39.37,85.73 43.18,85.73 44.45,84.45 U4.14 49.53,85.73 53.34,85.73 54.61,84.45 U5.14 59.69,85.73 63.5,85.73 64.77,84.45 U6.14 73.98,84.45 85.98,72.45 U17.49
VA1
  Top 0.254: U1.13 19.05,83.19 22.86,83.19 24.13,81.92 U2.13 29.21,83.19 33.02,83.19 34.29,81.92 U3.13 39.37,83.19 43.18,83.19 44.45,81.92 U4.13 49.53,83.19 53.34,83.19 54.61,81.92 U5.13 59.69,83.19 63.5,83.19 64.77,81.92 U6.13 75.25,81.92 86.49,70.68 U17.50
VA2
  Top 0.254: U1.6 12.7,81.92 13.97,80.65 17.78,80.65 U2.6 22.86,81.92 24.13,80.65 27.94,80.65 U3.6 33.02,81.92 34.29,80.65 38.1,80.65 U4.6 43.18,81.92 44.45,80.65 48.26,80.65 U5.6 53.34,81.92 54.61,80.65 58.42,80.65 U6.6 63.5,81.92 64.77,80.65 75.25,80.65 87,68.9 U17.51
VA3
  Top 0.254: U1.12 19.05,80.65 22.86,80.65 24.13,79.38 U2.12 29.21,80.65 33.02,80.65 34.29,79.38 U3.12 39.37,80.65 43.18,80.65 44.45,79.38 U4.12 49.53,80.65 53.34,80.65 54.61,79.38 U5.12 59.69,80.65 63.5,80.65 64.77,79.38 U6.12 75.25,79.38 87.5,67.12 U17.52
VA4
  Top 0.254: U1.7 12.7,79.38 13.97,78.11 17.78,78.11 U2.7 22.86,79.38 24.13,78.11 27.94,78.11 U3.7 33.02,79.38 34.29,78.11 38.1,78.11 U4.7 43.18,79.38 44.45,78.11 48.26,78.11 U5.7 53.34,79.38 54.61,78.11 58.42,78.11 U6.7 63.5,79.38 64.77,78.11 75.25,78.11 88.01,65.34 U17.53
VA5
  Top 0.254: U1.11 19.05,78.11 22.86,78.11 24.13,76.84 U2.11 29.21,78.11 33.02,78.11 34.29,76.84 U3.11 39.37,78.11 43.18,78.11 44.45,76.84 U4.11 49.53,78.11 53.34,78.11 54.61,76.84 U5.11 59.69,78.11 63.5,78.11 64.77,76.84 U6.11 75.25,76.84 88.52,63.56 U17.54
VA6
  Top 0.254: U1.8 12.7,76.84 13.97,75.56 17.78,75.56 U2.8 22.86,76.84 24.13,75.56 27.94,75.56 U3.8 33.02,76.84 34.29,75.56 38.1,75.56 U4.8 43.18,76.84 44.45,75.56 48.26,75.56 U5.8 53.34,76.84 54.61,75.56 58.42,75.56 U6.8 63.5,76.84 64.77,75.56 75.25,75.56 89.03,61.79 U17.55
VA7
  Top 0.254: U1.10 19.05,75.56 22.86,75.56 24.13,74.3 U2.10 29.21,75.56 33.02,75.56 34.29,74.3 U3.10 39.37,75.56 43.18,75.56 44.45,74.3 U4.10 49.53,75.56 53.34,75.56 54.61,74.3 U5.10 59.69,75.56 63.5,75.56 64.77,74.3 U6.10 75.25,74.3 89.53,60.01 U17.56
VCC  (via drill 0.5, 0.8)
  Top 0.254: U9.14 10.79,32.38 18.41,32.38 U9.10 | U8.13 51.44,48.89 50.16,48.89 | 50.16,48.89 42.55,48.89 | 42.55,48.89 40.01,48.89 | 40.01,48.89 36.2,48.89 U8.20 | U8.18 40.01,48.89 | U8.17 42.55,48.89 | U8.14 50.16,48.89 | U11.5 64.14,24.77 61.59,24.77 U11.3 | R3.2 v53.98,33.66 | R10.2 141.6,69.85 133.67,69.85 J5.4 | R6.2 120.02,75.88 | C22.P$1 R1.2 | U11.14 U11.13 | U13.4 U13.5 | v142.24,28.57 142.24,30.48 | v133.35,28.57 133.35,30.48
  Top 0.406: R15.1 158.75,53.97
  Top 0.61: U18.12 158.75,59.05 | 158.75,59.05 C28.P$1 158.75,53.97 C35.+ | C36.+ C29.1 165.74,66.67 U18.19 160.66,66.67 158.75,64.77 158.75,59.05
  Top 0.813: 124.46,20.32 C15.P$1 117.47,20.32 115.25,18.1 | 124.46,20.32 U15.20 | C13.P$1 132.08,30.48 | 132.08,30.48 133.35,30.48 142.24,30.48 C14.P$1 | U13.14 132.08,30.48 | 124.46,20.32 126.05,18.73 144.78,18.73 146.37,20.32 C16.P$1 | C9.P$1 7.62,28.57 8.57,27.62 25.72,27.62 26.67,28.57 C10.P$1 30.48,28.57 31.43,27.62 48.58,27.62 49.53,28.57 C11.P$1 53.34,28.57 54.29,27.62 71.44,27.62 72.39,28.57 C12.P$1 | C7.P$1 C8.P$1 64.14,45.09 | 64.14,45.09 74.61,45.09 | 74.61,45.09 v75.56,45.09 v75.56,44.13 74.61,45.09 | v64.14,44.29 64.14,45.09 | J5.4 120.02,78.42 | U17.21 111.03,81.34 111.41,81.73 C18.P$1 C33.+ 120.02,78.87 120.02,78.42 | 115.25,53.66 v114.3,53.66 v114.3,52.7 115.25,53.66 | 115.25,53.66 147.64,53.66 150.5,56.52 C28.P$1 | 115.25,60.32 v114.3,60.32 v114.3,59.37 115.25,60.32 | 115.25,60.32 118.11,60.32 120.02,62.23 120.02,75.88 120.02,78.42
  Top 1.016: U17.58 C17.P$1 | 13.97,16.51 v12.7,16.51 v13.34,17.14 13.97,16.51 | 13.97,16.51 51.75,16.51 | 51.75,16.51 53.98,16.51 | 53.98,16.51 75.56,16.51 | 75.56,16.51 77.79,16.51 | 77.79,16.51 102.87,16.51 107.95,21.59 C34.+ | 51.75,16.51 v52.39,17.14 v53.34,17.14 53.98,16.51 | 75.56,16.51 v76.2,17.14 v77.15,17.14 77.79,16.51 | 28.89,16.51 v29.53,17.14 v30.48,17.14 31.11,16.51 | C1.P$1 12.06,72.39 | 12.06,72.39 18.41,72.39 | 18.41,72.39 19.68,72.39 | 19.68,72.39 22.23,72.39 | 22.23,72.39 29.84,72.39 | 29.84,72.39 32.38,72.39 | 32.38,72.39 40.01,72.39 | 40.01,72.39 42.55,72.39 | 42.55,72.39 50.16,72.39 | 50.16,72.39 52.7,72.39 | 52.7,72.39 60.33,72.39 | 60.33,72.39 60.96,72.39 C6.P$1 | U6.9 60.33,72.39 | C2.P$1 22.23,72.39 | U2.9 19.68,72.39 | U3.9 29.84,72.39 | C3.P$1 32.38,72.39 | U4.9 40.01,72.39 | C4.P$1 42.55,72.39 | U5.9 50.16,72.39 | C5.P$1 52.7,72.39 | 12.06,72.39 9.53,72.39 | 9.53,72.39 U1.9 | 8.89,72.39 v7.62,72.39 v8.26,71.76 8.89,72.39 | 8.89,72.39 9.53,72.39 | C31.+ 18.41,72.39
  Top 1.651: CE1.6 119.38,8.89 | 119.38,8.89 v120.65,10.16 v120.65,11.43 v120.65,12.7 119.38,13.97 | 119.38,13.97 115.25,18.1 C34.+ | 119.38,8.89 119.38,13.97
  Bottom 0.254: U15.4 133.35,16.51 133.35,22.86 | U9.10 20.95,32.38 20.95,35.24 22.23,36.51 U7.6 | R2.2 7.62,33.66 | U8.8 U8.13 | U9.2 12.06,26.35 10.79,27.62 10.79,29.85 U9.14 | v53.98,33.66 55.24,32.38 U11.14 | R3.2 43.81,32.38 43.81,27.94 42.55,26.67 U10.5 | 53.34,22.23 59.05,22.23 U11.3 | U17.27 108.58,90.74 108.58,82.61 U17.21 | U17.4 110.81,51.12 111.76,50.16 | U10.11 38.73,29.85 33.66,29.85 U10.14 | U13.5 v142.24,28.57 | 133.35,22.86 v133.35,28.57 | U15.17 133.35,22.86
  Bottom 0.406: 80.8,28.26 83.03,28.26 | 80.49,28.26 76.2,28.26 | 83.34,28.26 85.57,28.26 | 85.88,28.26 88.11,28.26 | 88.42,28.26 90.65,28.26 | 90.96,28.26 93.19,28.26 | 93.5,28.26 95.73,28.26 | 96.04,28.26 98.27,28.26
  Bottom 0.813: U14.20 153.03,33.02 | 153.03,33.02 153.03,30.48 | 153.03,30.48 153.03,22.86 | 153.03,22.86 153.03,21.27 152.08,20.32 C16.P$1 | U16.20 153.03,22.86 | C14.P$1 153.03,30.48 | 153.03,33.02 153.03,34.61 153.99,35.56 RN1.1 | U7.16 7.62,47.62 | 7.62,45.09 C7.P$1 | U9.14 7.62,31.12 | 7.62,28.57 C9.P$1 | 33.02,45.09 33.02,47.62 U8.20 | 33.02,45.09 33.02,36.51 30.48,33.97 30.48,31.12 | 30.48,31.12 30.48,28.57 | 30.48,28.57 C10.P$1 | U10.14 30.48,31.12 | C8.P$1 33.02,45.09 | U11.14 53.34,29.21 53.34,28.57 | 53.34,28.57 C11.P$1 | 53.34,28.57 53.34,22.23 53.34,18.1 | 53.34,18.1 v53.34,17.14 v52.39,17.14 53.34,18.1 | 30.48,28.57 30.48,18.1 | 80.49,28.26 80.8,28.26 | C22.P$1 Y1.8 v64.14,44.29 Y1.1 | C17.P$1 C32.+ | 30.48,18.1 v30.48,17.14 v29.53,17.14 30.48,18.1 | 83.03,28.26 83.34,28.26 | 85.57,28.26 85.88,28.26 | 88.11,28.26 88.42,28.26 | 90.65,28.26 90.96,28.26 | 93.19,28.26 93.5,28.26 | 95.73,28.26 96.04,28.26 | 98.27,28.26 98.58,28.26 | C34.+ 111.76,50.16 113.67,52.07 | 113.67,52.07 113.67,54.29 | U17.21 111.03,81.34 111.41,81.73 C18.P$1 C33.+ | 113.67,54.29 v114.3,53.66 v114.3,52.7 113.67,52.07 | 113.67,54.29 113.67,58.74 | 113.67,58.74 113.67,59.69 v114.3,60.32 v114.3,59.37 113.67,58.74 | U17.21 110.49,81.34 | 109.79,81.28 U17.21
  Bottom 1.016: 76.2,28.57 76.2,31.12 | U12.20 76.2,31.12 | 76.2,31.12 76.2,43.5 | 76.2,43.5 76.2,45.72 | 76.2,45.72 76.2,49.53 79.38,52.7 84.52,52.7 C17.P$1 U17.58 | C12.P$1 76.2,28.57 | 76.2,28.57 76.2,28.26 76.2,18.1 | 12.06,17.14 7.62,21.59 7.62,28.57 7.62,31.12 7.62,33.66 7.62,45.09 7.62,47.62 7.62,71.12 | 12.06,17.14 v12.7,16.51 v13.34,17.14 12.06,17.14 | 76.2,18.1 v77.15,17.14 v76.2,17.14 76.2,18.1 | 76.2,45.72 v75.56,45.09 v75.56,44.13 76.2,43.5 | 7.62,71.12 v7.62,72.39 v8.26,71.76 7.62,71.12
  Bottom 1.651: 119.38,8.89 v120.65,10.16 v120.65,11.43 v120.65,12.7 119.38,11.43 119.38,8.89 | 119.38,8.89 CE1.6
VD0
  Top 0.254: U4.17 49.53,93.34 53.34,93.34 54.61,92.08 U5.17 59.69,93.34 63.5,93.34 64.77,92.08 U6.17 83.19,92.08 88.58,86.68 U17.41
VD1
  Top 0.254: U4.2 43.18,92.08 44.45,90.81 48.26,90.81 U5.2 53.34,92.08 54.61,90.81 58.42,90.81 U6.2 63.5,92.08 64.77,90.81 82.87,90.81 88.77,84.9 U17.42
VD2
  Top 0.254: U4.3 43.18,89.54 44.45,88.27 48.26,88.27 U5.3 53.34,89.54 54.61,88.27 58.42,88.27 U6.3 63.5,89.54 64.77,88.27 83.82,88.27 88.96,83.12 U17.43
VD3
  Top 0.254: U4.15 49.53,88.27 53.34,88.27 54.61,87 U5.15 59.69,88.27 63.5,88.27 64.77,87 U6.15 83.5,87 89.15,81.34 U17.44
VD4  (via drill 0.5)
  Top 0.254: U1.2 12.7,92.08 13.97,90.81 17.78,90.81 U2.2 22.86,92.08 24.13,90.81 27.94,90.81 U3.2 | U17.45 89.34,79.56 v83.82,85.09 | v64.45,63.82 60.96,67.31 48.26,67.31 47.31,68.26 v31.11,68.26
  Bottom 0.254: U3.2 31.11,90.81 v31.11,68.26 | v83.82,85.09 80.96,82.23 80.96,77.79 66.99,63.82 v64.45,63.82
VD5  (via drill 0.5)
  Top 0.254: U1.3 12.7,89.54 13.97,88.27 17.78,88.27 U2.3 22.86,89.54 24.13,88.27 27.94,88.27 U3.3 | U17.46 89.53,77.79 v83.82,83.5 | v65.41,62.86 64.14,62.86 60.33,66.67 47.94,66.67 47.31,67.31 29.53,67.31 v28.57,68.26
  Bottom 0.254: U3.3 28.57,88.27 v28.57,68.26 | v83.82,83.5 81.92,81.6 81.92,77.47 67.31,62.86 v65.41,62.86
VD6  (via drill 0.5)
  Top 0.254: U1.15 19.05,88.27 22.86,88.27 24.13,87 U2.15 29.21,88.27 33.02,88.27 34.29,87 U3.15 | U17.47 89.72,76.01 v83.82,81.92 | v66.36,61.91 63.82,61.91 59.69,66.04 47.62,66.04 47.31,66.36 v38.73,66.36
  Bottom 0.254: U3.15 38.73,85.73 v38.73,66.36 | v83.82,81.92 82.87,80.96 82.87,77.15 67.63,61.91 v66.36,61.91
VD7  (via drill 0.5)
  Top 0.254: U1.17 19.05,93.34 22.86,93.34 24.13,92.08 U2.17 29.21,93.34 33.02,93.34 34.29,92.08 U3.17 | U17.48 89.92,74.23 v83.82,80.33 | v67.31,60.96 63.82,60.96 59.37,65.41 37.15,65.41 v36.2,66.36
  Bottom 0.254: U3.17 36.2,90.81 v36.2,66.36 | v83.82,80.33 83.82,76.84 67.94,60.96 v67.31,60.96
VR/!W  (via drill 0.5)
  Top 0.254: U1.4 12.7,87 13.97,85.73 17.78,85.73 U2.4 22.86,87 24.13,85.73 27.94,85.73 U3.4 33.02,87 34.29,85.73 38.1,85.73 U4.4 43.18,87 44.45,85.73 48.26,85.73 U5.4 53.34,87 54.61,85.73 58.42,85.73 U6.4 63.5,87 64.77,85.73 v70.17,85.73 | U17.57 90.04,58.23 75.25,73.03 v70.17,73.03
  Bottom 0.254: v70.17,85.73 v70.17,73.03

## Text on the board
tPlace: JLCJLCJLCJLC | CHRIS WEIR 2019
bPlace: CARD ID | 1 | 0 | 0 | 1 | 2 | 3 | 4 | 5 | 6 | 7
tNames: XMICRO-VDP | B | R | G | +5V | R | G | C0 | C1 | GND | C2 | C3 | GND | B | C4 | C5 | SC | C6 | C7 | !CSYNC | DR | !DL | NTSC | !DH | GND | PAL | WAIT ON !CSX! | WAIT STATES | IRQX | NMI
tValues: V1.1 1949